# Altium project CAN.PrjPcb
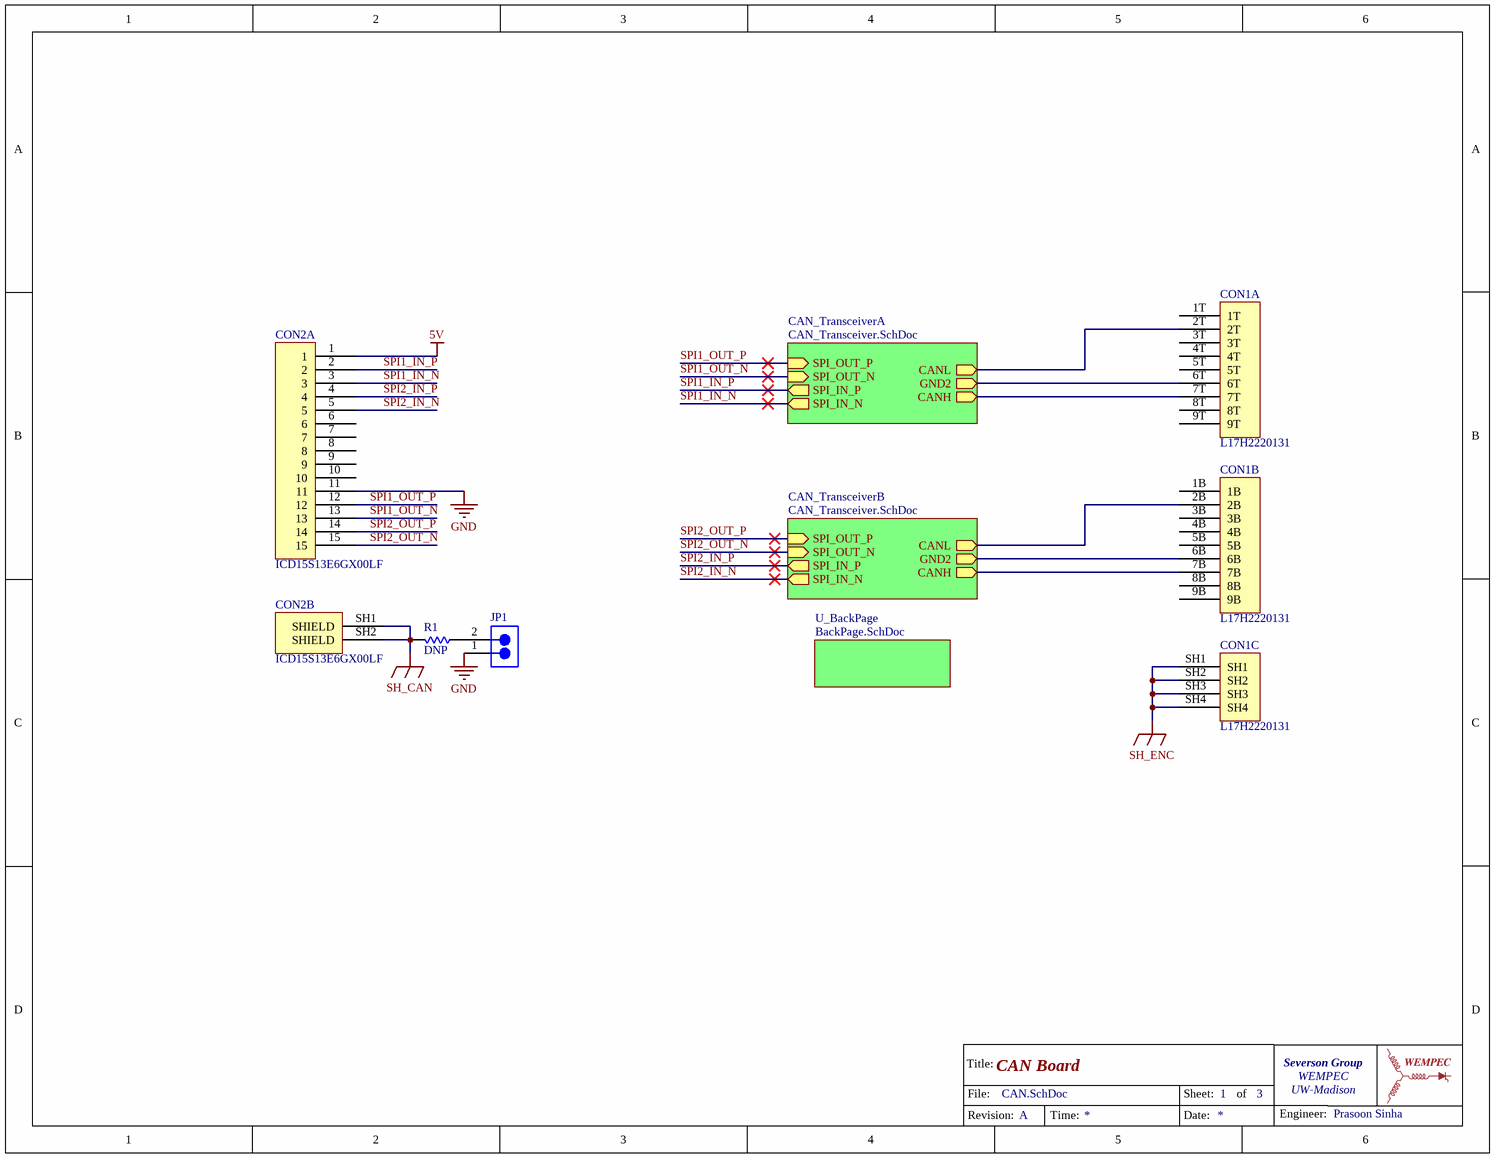
[diagram p0: CAN.SchDoc]
ProjectGroup: Severson Group; ProjectOrganization: WEMPEC; ProjectRev: A; ProjectUniversity: UW-Madison
3 sheets, 59 parts. Net scope: hierarchical (ports join the sheet entries above them; power ports are global).
Board file: CAN.PcbDoc
Sheets:
  CAN.SchDoc
    CAN_TransceiverA = CAN_Transceiver.SchDoc
    CAN_TransceiverB = CAN_Transceiver.SchDoc
    U_BackPage = BackPage.SchDoc

## Sheet CAN.SchDoc: CAN Board
size 279 x 215 mm; Engineer: Prasoon Sinha; SheetNumber: 1; SheetTotal: 3

### Parts
*?  TitleBlockWEMPEC  (value not drawn)  (graphical)
CON1  L17H2220131  [L17H2220131]  (parts A,B,C of 3)
CON2  ICD15S13E6GX00LF  [ICD15S]  (parts A,B of 2)
JP1  Jumper2  [PIN_HEADER_1x2]  (value not drawn)
R1  value DNP  [0603_RES]  (hidden comment: Resistor)

### Sub-sheets
CAN_TransceiverA = CAN_Transceiver.SchDoc: SPI_IN_N (out), SPI_IN_P (out), SPI_OUT_N (in), SPI_OUT_P (in), CANH (out), CANL (out), GND2 (out)
CAN_TransceiverB = CAN_Transceiver.SchDoc: SPI_IN_N (out), SPI_IN_P (out), SPI_OUT_N (in), SPI_OUT_P (in), CANH (out), CANL (out), GND2 (out)
U_BackPage = BackPage.SchDoc: no entries

### Nets
5V: CON2.1
GND: CON2.11 JP1.1
SH_CAN: CON2.SH1(SHIELD) CON2.SH2(SHIELD) R1.2
SH_ENC: CON1.SH1 CON1.SH2 CON1.SH3 CON1.SH4
CANH: CON1.7T ; sheet CAN_TransceiverA/CANH
CANH: CON1.7B ; sheet CAN_TransceiverB/CANH  [a separate net that carries the same name]
CANL: CON1.2T ; sheet CAN_TransceiverA/CANL
CANL: CON1.2B ; sheet CAN_TransceiverB/CANL  [a separate net that carries the same name]
GND2: CON1.6T ; sheet CAN_TransceiverA/GND2
GND2: CON1.6B ; sheet CAN_TransceiverB/GND2  [a separate net that carries the same name]
SPI1_IN_N: CON2.3 ; sheet CAN_TransceiverA/SPI_IN_N
SPI1_IN_P: CON2.2 ; sheet CAN_TransceiverA/SPI_IN_P
SPI1_OUT_N: CON2.13 ; sheet CAN_TransceiverA/SPI_OUT_N
SPI1_OUT_P: CON2.12 ; sheet CAN_TransceiverA/SPI_OUT_P
SPI2_IN_N: CON2.5 ; sheet CAN_TransceiverB/SPI_IN_N
SPI2_IN_P: CON2.4 ; sheet CAN_TransceiverB/SPI_IN_P
SPI2_OUT_N: CON2.15 ; sheet CAN_TransceiverB/SPI_OUT_N
SPI2_OUT_P: CON2.14 ; sheet CAN_TransceiverB/SPI_OUT_P
NetJP1_2: JP1.2 R1.1

Not connected (* = marked no-connect by the designer): CON1 1B 1T 3B 3T 4B 4T 5B 5T 8B 8T 9B 9T; CON2 6 7 8 9 10

### Notes on the sheet
- (in symbol TitleBlockWEMPEC) Title:; File:; Sheet:; of; Engineer:; Revision:; Time:; Date:

### Library data of the parts
CON1 = L17H2220131: CONN D-SUB RCPT 9POS R/A SLDR; Supplier Part 1: Digi-Key; Supplier Part Number 1: L17H2220131-ND
CON2 = ICD15S13E6GX00LF: CONN DSUB HD RCPT 15POS R/A SLDR; Supplier 1: Digi-Key; Supplier Part Number 1: 609-2801-ND
JP1 = Jumper2: Supplier 1: Digi-Key; Supplier Part Number 1: 732-5315-ND
R1 = Resistor: Supplier 1: Digi-Key; Supplier Part Number 1: P0.0GDKR-ND

## Sheet CAN_Transceiver.SchDoc: CAN Transceiver
size 279 x 215 mm; Engineer: Prasoon Sinha; Revision: A; SheetNumber: 2; SheetTotal: 3
Used 2 times, as channels CAN_TransceiverA, CAN_TransceiverB. Parts and nets are listed once, with the designators drawn on the sheet.
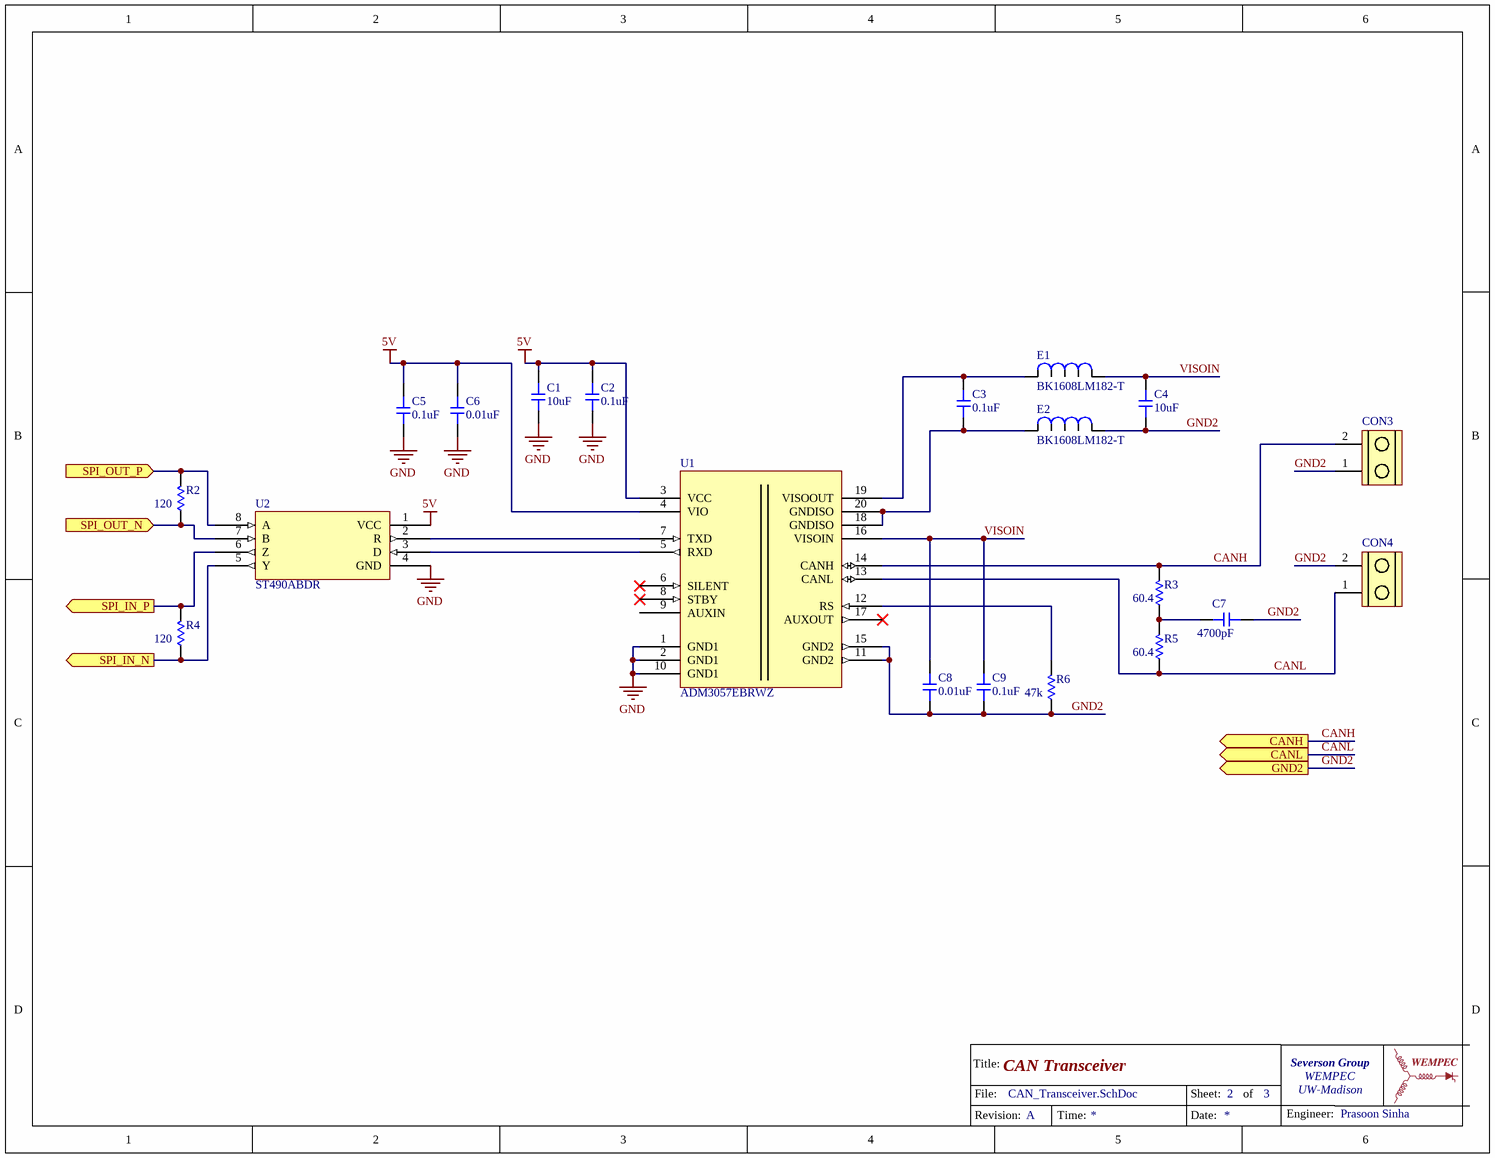
[diagram p1: CAN_Transceiver.SchDoc]

### Parts
*?  TitleBlockWEMPEC  (value not drawn)  (graphical)
C1  value 10uF  [0603_CAP]  (hidden comment: Capacitor)
C2  value 0.1uF  [0603_CAP]  (hidden comment: Capacitor)
C3  value 0.1uF  [0603_CAP]  (hidden comment: Capacitor)
C4  value 10uF  [0603_CAP]  (hidden comment: Capacitor)
C5  value 0.1uF  [0603_CAP]  (hidden comment: Capacitor)
C6  value 0.01uF  [0603_CAP]  (hidden comment: Capacitor)
C7  value 4700pF  [0603_CAP]  (hidden comment: Capacitor)
C8  value 0.01uF  [0603_CAP]  (hidden comment: Capacitor)
C9  value 0.1uF  [0603_CAP]  (hidden comment: Capacitor)
CON3  ScrewTerminal_1x2  [1935161]  (value not drawn)
CON4  ScrewTerminal_1x2  [1935161]  (value not drawn)
E1  BK1608LM182-T  [BK0603_TAY]
E2  BK1608LM182-T  [BK0603_TAY]
R2  value 120  [0603_RES]  (hidden comment: Resistor)
R3  value 60.4  [0603_RES]  (hidden comment: Resistor)
R4  value 120  [0603_RES]  (hidden comment: Resistor)
R5  value 60.4  [0603_RES]  (hidden comment: Resistor)
R6  value 47k  [0603_RES]  (hidden comment: Resistor)
U1  ADM3057EBRWZ  [RW-20_ADI]
U2  ST490ABDR  [SO-8_STM]

### Ports
CANH (out), CANL (out), GND2 (out), SPI_IN_N (out), SPI_IN_P (out), SPI_OUT_N (in), SPI_OUT_P (in)

### Nets
5V: C1.2 C2.2 C5.2 C6.2 U1.3(VCC) U1.4(VIO) U2.1(VCC)
GND: C1.1 C2.1 C5.1 C6.1 U1.1(GND1) U1.2(GND1) U1.10(GND1) U2.4(GND)
CANH: CON3.2 R3.2 U1.14(CANH) ; port CANH
CANL: CON4.1 R5.1 U1.13(CANL) ; port CANL
GND2: C4.1 C7.2 C8.1 C9.1 CON3.1 CON4.2 E2.1 R6.1 U1.11(GND2) U1.15(GND2) ; port GND2
SPI_IN_N: R4.1 U2.5(Y) ; port SPI_IN_N
SPI_IN_P: R4.2 U2.6(Z) ; port SPI_IN_P
SPI_OUT_N: R2.1 U2.7(B) ; port SPI_OUT_N
SPI_OUT_P: R2.2 U2.8(A) ; port SPI_OUT_P
VISOIN: C4.2 C8.2 C9.2 E1.1 U1.16(VISOIN)
NetC3_1: C3.1 E2.2 U1.18(GNDISO) U1.20(GNDISO)
NetC3_2: C3.2 E1.2 U1.19(VISOOUT)
NetC7_1: C7.1 R3.1 R5.2
NetR6_2: R6.2 U1.12(RS)
NetU1_5: U1.5(RXD) U2.3(D)
NetU1_7: U1.7(TXD) U2.2(R)

Not connected (* = marked no-connect by the designer): U1 6(SILENT)* 8(STBY)* 9(AUXIN) 17(AUXOUT)*

### Channels
CAN_TransceiverA: designators end in A; ports CANH=CANH CANL=CANL GND2=GND2 SPI_IN_N=SPI1_IN_N SPI_IN_P=SPI1_IN_P SPI_OUT_N=SPI1_OUT_N SPI_OUT_P=SPI1_OUT_P
CAN_TransceiverB: designators end in B; ports CANH=CANH CANL=CANL GND2=GND2 SPI_IN_N=SPI2_IN_N SPI_IN_P=SPI2_IN_P SPI_OUT_N=SPI2_OUT_N SPI_OUT_P=SPI2_OUT_P

### Notes on the sheet
- (in symbol TitleBlockWEMPEC) Title:; File:; Sheet:; of; Engineer:; Revision:; Time:; Date:

### Library data of the parts
E1 E2 = BK1608LM182-T: FERRITE BEAD 1.8 KOHM 0603 1LN; Supplier 1: Digi-Key; Supplier Part Number 1: 587-1892-1-ND
U1 = ADM3057EBRWZ: Transceiver, Isolated 20-SOIC; Supplier Part Number 1: ADM3057EBRWZ-ND; Supplier 1: Digi-Key
U2 = ST490ABDR: 1/1 Transceiver Full RS422, RS485 8-SO; Supplier 1: Digi-Key; Supplier Part Number 1: 497-2091-1-ND
C1-C9 = Capacitor: Supplier 1: Digi-Key
  C1 C4: Supplier Part Number 1: 490-18214-1-ND
  C2 C3 C5 C9: Supplier Part Number 1: 1292-1390-1-ND
  C6 C8: Supplier Part Number 1: 399-8985-1-ND
  C7: Supplier Part Number 1: 399-9087-1-ND
CON3 CON4 = ScrewTerminal_1x2: Supplier 1: Digi-Key; Supplier Part Number 1: 277-1667-ND
R2-R6 = Resistor: Supplier 1: Digi-Key
  R2 R4: Supplier Part Number 1: 311-120HRCT-ND
  R3 R5: Supplier Part Number 1: 541-5507-1-ND
  R6: Supplier Part Number 1: 541-47.0KHCT-ND

## Sheet BackPage.SchDoc: Back Page
size Letter; Engineer: Nathan Petersen; SheetNumber: 3; SheetTotal: 3
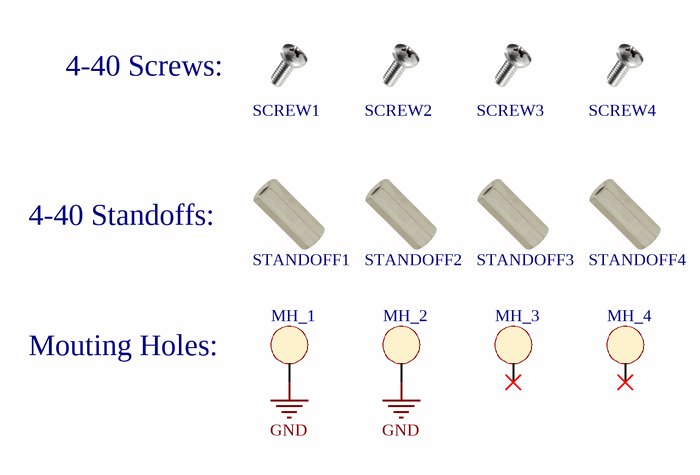
[diagram p2: BackPage.SchDoc]

### Parts
MH_1  MOUNTING_HOLE  [MOUNTING_HOLE]  (value not drawn)  (no BOM)
MH_2  MOUNTING_HOLE  [MOUNTING_HOLE]  (value not drawn)  (no BOM)
MH_3  MOUNTING_HOLE  [MOUNTING_HOLE]  (value not drawn)  (no BOM)
MH_4  MOUNTING_HOLE  [MOUNTING_HOLE]  (value not drawn)  (no BOM)
SCREW1  Screw-4-40  (value not drawn)  (mechanical)
SCREW2  Screw-4-40  (value not drawn)  (mechanical)
SCREW3  Screw-4-40  (value not drawn)  (mechanical)
SCREW4  Screw-4-40  (value not drawn)  (mechanical)
STANDOFF1  Standoff-4-40  (value not drawn)  (mechanical)
STANDOFF2  Standoff-4-40  (value not drawn)  (mechanical)
STANDOFF3  Standoff-4-40  (value not drawn)  (mechanical)
STANDOFF4  Standoff-4-40  (value not drawn)  (mechanical)

### Nets
GND: MH_1.1 MH_2.1

Not connected (* = marked no-connect by the designer): MH_3 1*; MH_4 1*

### Notes on the sheet
- (near SCREW1) 4-40 Screws:
- (near STANDOFF1) 4-40 Standoffs:
- Mouting Holes:
- Title:
- File:
- Sheet:
- of
- Revision:
- Time:
- Date:
- Engineer:

### Library data of the parts
SCREW1-SCREW4 = Screw-4-40: Supplier 1: Digi-Key; Supplier Part Number 1: KEY1046-ND
STANDOFF1-STANDOFF4 = Standoff-4-40: Supplier 1: Digi-Key; Supplier Part Number 1: 36-1656-ND

## Nets that join several sheets
5V: CAN (CON2.1), CAN_TransceiverA (7 pins), CAN_TransceiverB (7 pins)
GND: CAN (CON2.11 JP1.1), CAN_TransceiverA (8 pins), CAN_TransceiverB (8 pins), BackPage (MH_1.1 MH_2.1)
CANH: CAN (CON1.7T), CAN_TransceiverA (CON3A.2 R3A.2 U1A.14)
CANH: CAN (CON1.7B), CAN_TransceiverB (CON3B.2 R3B.2 U1B.14)
CANL: CAN (CON1.2T), CAN_TransceiverA (CON4A.1 R5A.1 U1A.13)
CANL: CAN (CON1.2B), CAN_TransceiverB (CON4B.1 R5B.1 U1B.13)
GND2: CAN (CON1.6T), CAN_TransceiverA (10 pins)
GND2: CAN (CON1.6B), CAN_TransceiverB (10 pins)
SPI1_IN_N: CAN (CON2.3), CAN_TransceiverA (R4A.1 U2A.5)
SPI1_IN_P: CAN (CON2.2), CAN_TransceiverA (R4A.2 U2A.6)
SPI1_OUT_N: CAN (CON2.13), CAN_TransceiverA (R2A.1 U2A.7)
SPI1_OUT_P: CAN (CON2.12), CAN_TransceiverA (R2A.2 U2A.8)
SPI2_IN_N: CAN (CON2.5), CAN_TransceiverB (R4B.1 U2B.5)
SPI2_IN_P: CAN (CON2.4), CAN_TransceiverB (R4B.2 U2B.6)
SPI2_OUT_N: CAN (CON2.15), CAN_TransceiverB (R2B.1 U2B.7)
SPI2_OUT_P: CAN (CON2.14), CAN_TransceiverB (R2B.2 U2B.8)